# EAGLE schematic tablet (EAGLE 8.4.3)
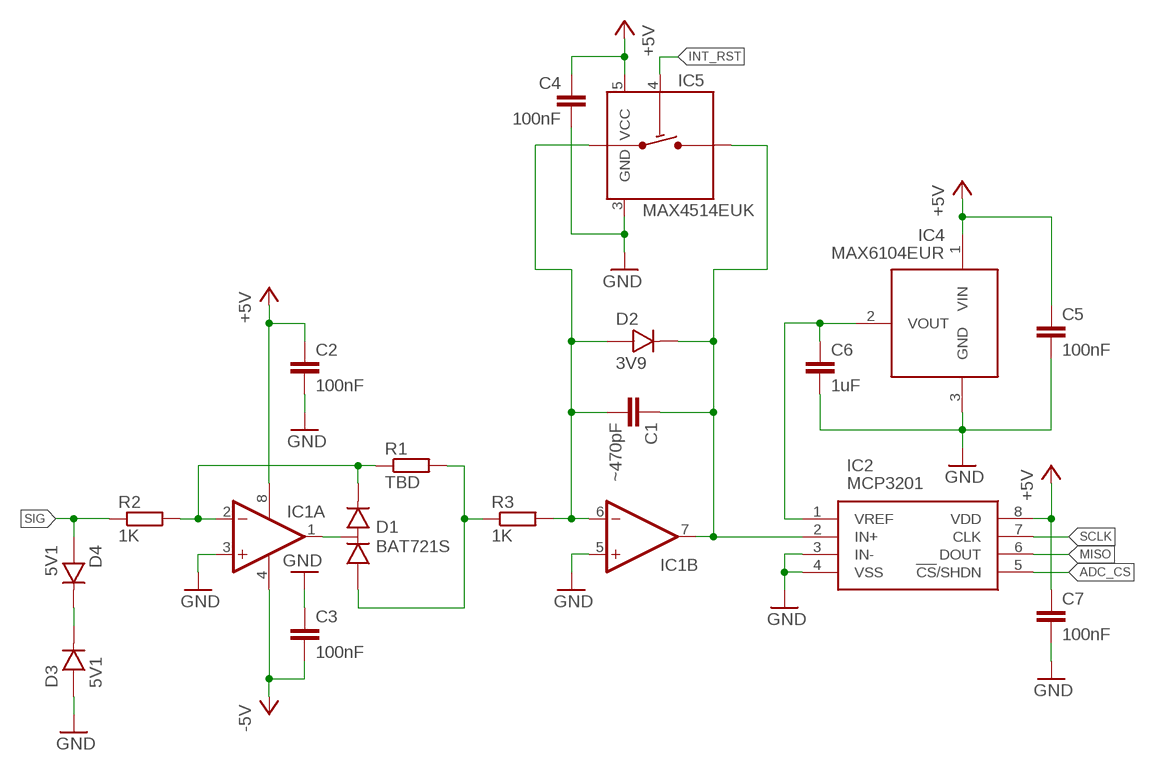
[diagram p0: schematic, sheet 1]

## Parts
C1  ~470pF  C0603  [0603]
C2  100nF  C0603  [0603]
C3  100nF  C0603  [0603]
C4  100nF  C0603  [0603]
C5  100nF  C0603  [0603]
C6  1uF  C0603  [0603]
C7  100nF  C0603  [0603]
D1  BAT721S  D2_SERIESSOT23  [SOT23_3]
D2  3V9  DSOD323  [SOD323]
D3  5V1  DSOD323  [SOD323]
D4  5V1  DSOD323  [SOD323]
IC1  OPAMP_DUALSOIC8  [SOIC8]
IC2  MCP3201  [SOIC8]
IC4  MAX6104EUR  [SOT23_3]
IC5  MAX4514EUK  [SOT23_5]
R1  TBD  R0603  [0603]
R2  1K  R0603  [0603]
R3  1K  R0603  [0603]

## Nets
+5V: C2.1 C4.1 C5.1 C7.1 IC1.8(PWR:V+) IC2.8(VDD) IC4.1(VIN) IC5.5(VCC)
-5V: C3.2 IC1.4(PWR:V-)
ADC_CS: IC2.5(!CS!/SHDN)
GND: C2.2 C3.1 C4.2 C5.2 C6.2 C7.2 D3.1 IC1.3(A:+IN) IC1.5(B:+IN) IC2.3(IN-) IC2.4(VSS) IC4.3(GND) IC5.3(GND)
INT_RST: IC5.4(IN)
MISO: IC2.6(DOUT)
N$1: D1.1(A) R1.2 R3.1
N$2: D1.2(C) IC1.2(A:-IN) R1.1 R2.2
N$3: D1.3(COM) IC1.1(A:OUT)
N$4: C1.2 D2.1 IC1.6(B:-IN) IC5.1(COM) R3.2
N$5: D3.2 D4.2
N$6: C6.1 IC2.1(VREF) IC4.2(VOUT)
SCLK: IC2.7(CLK)
SIG: D4.1 R2.1
VOUT: C1.1 D2.2 IC1.7(B:OUT) IC2.2(IN+) IC5.2(NO)

## Library data of the parts
C1-C7 = 0jpe:C
D1 = 0jpe:D2_SERIES
D2-D4 = 0jpe:D
IC1 = 0jpe:OPAMP_DUAL
IC2 = 0jpe:MCP3201
IC4 = 0jpe:MAX6104
IC5 = 0jpe:MAX4514
R1-R3 = 0jpe:R